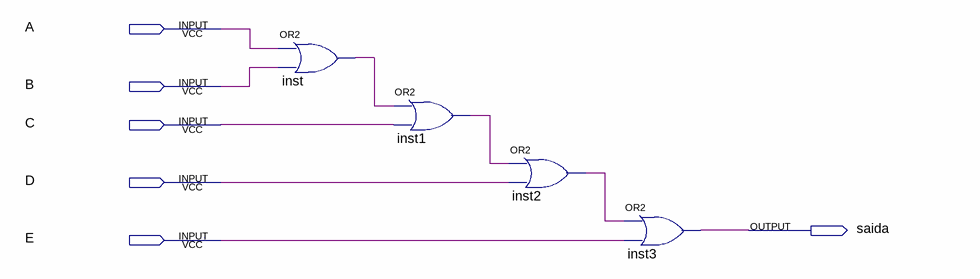
[diagram p0: schematic sheet]
// Quartus schematic OR5entradas.bdf as structural Verilog: 4 symbols, 6 pins
module OR5entradas (
  input  A,
  input  B,
  input  C,
  input  D,
  input  E,
  output saida
);

  wire inst1_out, inst2_out, inst_out;

  or inst (inst_out, A, B);
  or inst1 (inst1_out, inst_out, C);
  or inst2 (inst2_out, inst1_out, D);
  or inst3 (saida, inst2_out, E);
endmodule
